# EAGLE schematic GIP-gps (EAGLE 9.1.3)
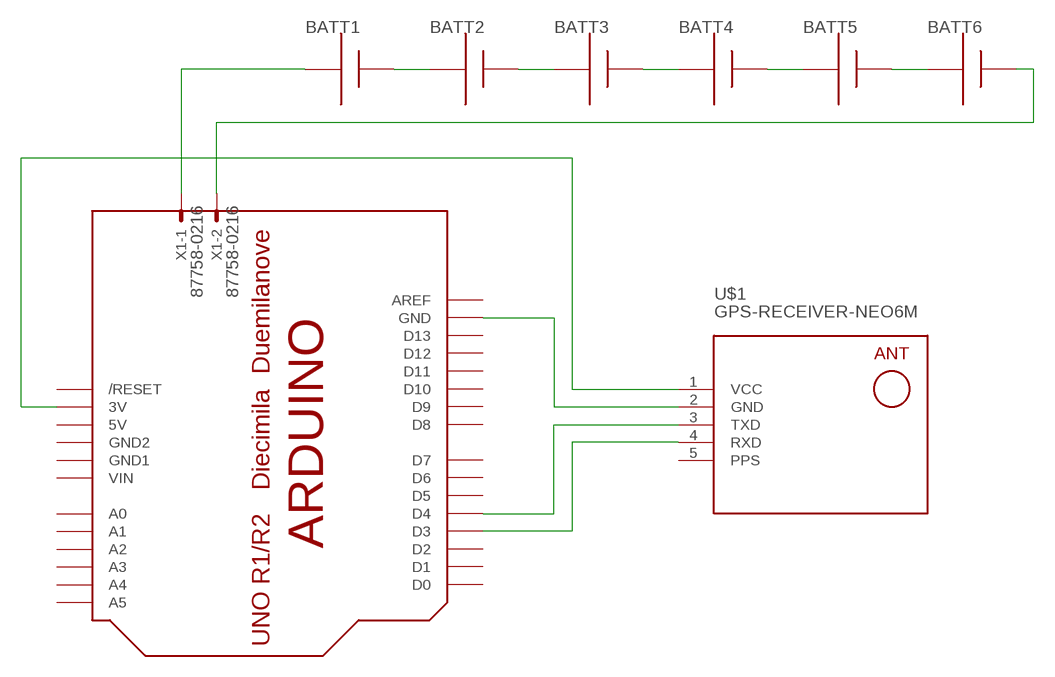
[diagram p0: schematic, sheet 1]

## Parts
BATT1  AAA  [12BH412]
BATT2  AAA  [12BH412]
BATT3  AAA  [12BH412]
BATT4  AAA  [12BH412]
BATT5  AAA  [12BH412]
BATT6  AAA  [12BH412]
U$1  GPS-RECEIVER-NEO6M  [GPS-RECEIVER-NEO6M]
U$2  ARDUINO-BPLACE  [ARDUINO-BPLACE]
X1  87758-0216  [87758-0216]

## Nets
N$1: U$1.4(RXD) U$2.D3
N$2: U$1.3(TXD) U$2.D4
N$3: U$1.2(GND) U$2.GND
N$5: BATT1.+ BATT2.-
N$6: BATT2.+ BATT3.-
N$7: BATT3.+ BATT4.-
N$8: BATT4.+ BATT5.-
N$9: BATT5.+ BATT6.-
N$10: BATT1.- X1.1
N$11: BATT6.+ X1.2
N$12: U$1.1(VCC) U$2.3V
Unconnected: U$2.A0 U$2.A1 U$2.A2 U$2.A3 U$2.A4 U$2.A5 U$2.AREF U$2.D0 U$2.D1 U$2.D2 U$2.D5 U$2.D6 U$2.D7 U$2.D8 U$2.D9 U$2.D10 U$2.D11 U$2.D12 U$2.D13 U$2.RESET(/RESET)

## Power pins joined to a net without a drawn wire
5V: U$2.5V
GND1: U$2.GND1
GND2: U$2.GND2
PPS: U$1.5(PPS)
VIN: U$2.VIN

## Library data of the parts
BATT1-BATT6 = adafruit:AAA: AAA PC pin holder Mouser part #12BH412 - but pretty much any 1x AAA battery holder should be the same http://www.ladyada.net/library/pcb/eaglelibrary.html
U$1 = diy-modules:GPS-RECEIVER-NEO6M: GPS Receiver Module based on NEO-6 device Short tutorial how to use NEO-6 module with Arduino: http://www.xarg.org/2016/06/neo6mv2-gps-module-with-arduino/ NEO-6 datasheet is available here: https://www.u-blox.com/sites/default/files/products/documents/NEO-6_DataSheet_%28GPS.G6-HW-09005%29.pdf Click here to find device on ebay.com <http://www.ebay.com/sch/gyneo6mv2>
U$2 = adafruit:ARDUINO: Arduino Diecimila/Duemilanove Make a shield with ease, this package has all the named pins as well as the two mounting drill holes and an outline of the USB and DC power connector. The outline is on the DIMENSION layer, so if your board house uses it they will cut the outline to match. http://www.ladyada.net/library/pcb/eaglelibrary.html
X1 = con-molex:87758-0216: 2 Pin - 2mm Dual Row Single Wafer, Vertical T/H HDR Source: http://www.molex.com/pdm_docs/sd/877580616_sd.pdf; MF: MOLEX; MPN: 87758-0216; OC_FARNELL: unknown; OC_NEWARK: 94M1513